# EAGLE design CamAdapter (EAGLE 6.5.0)
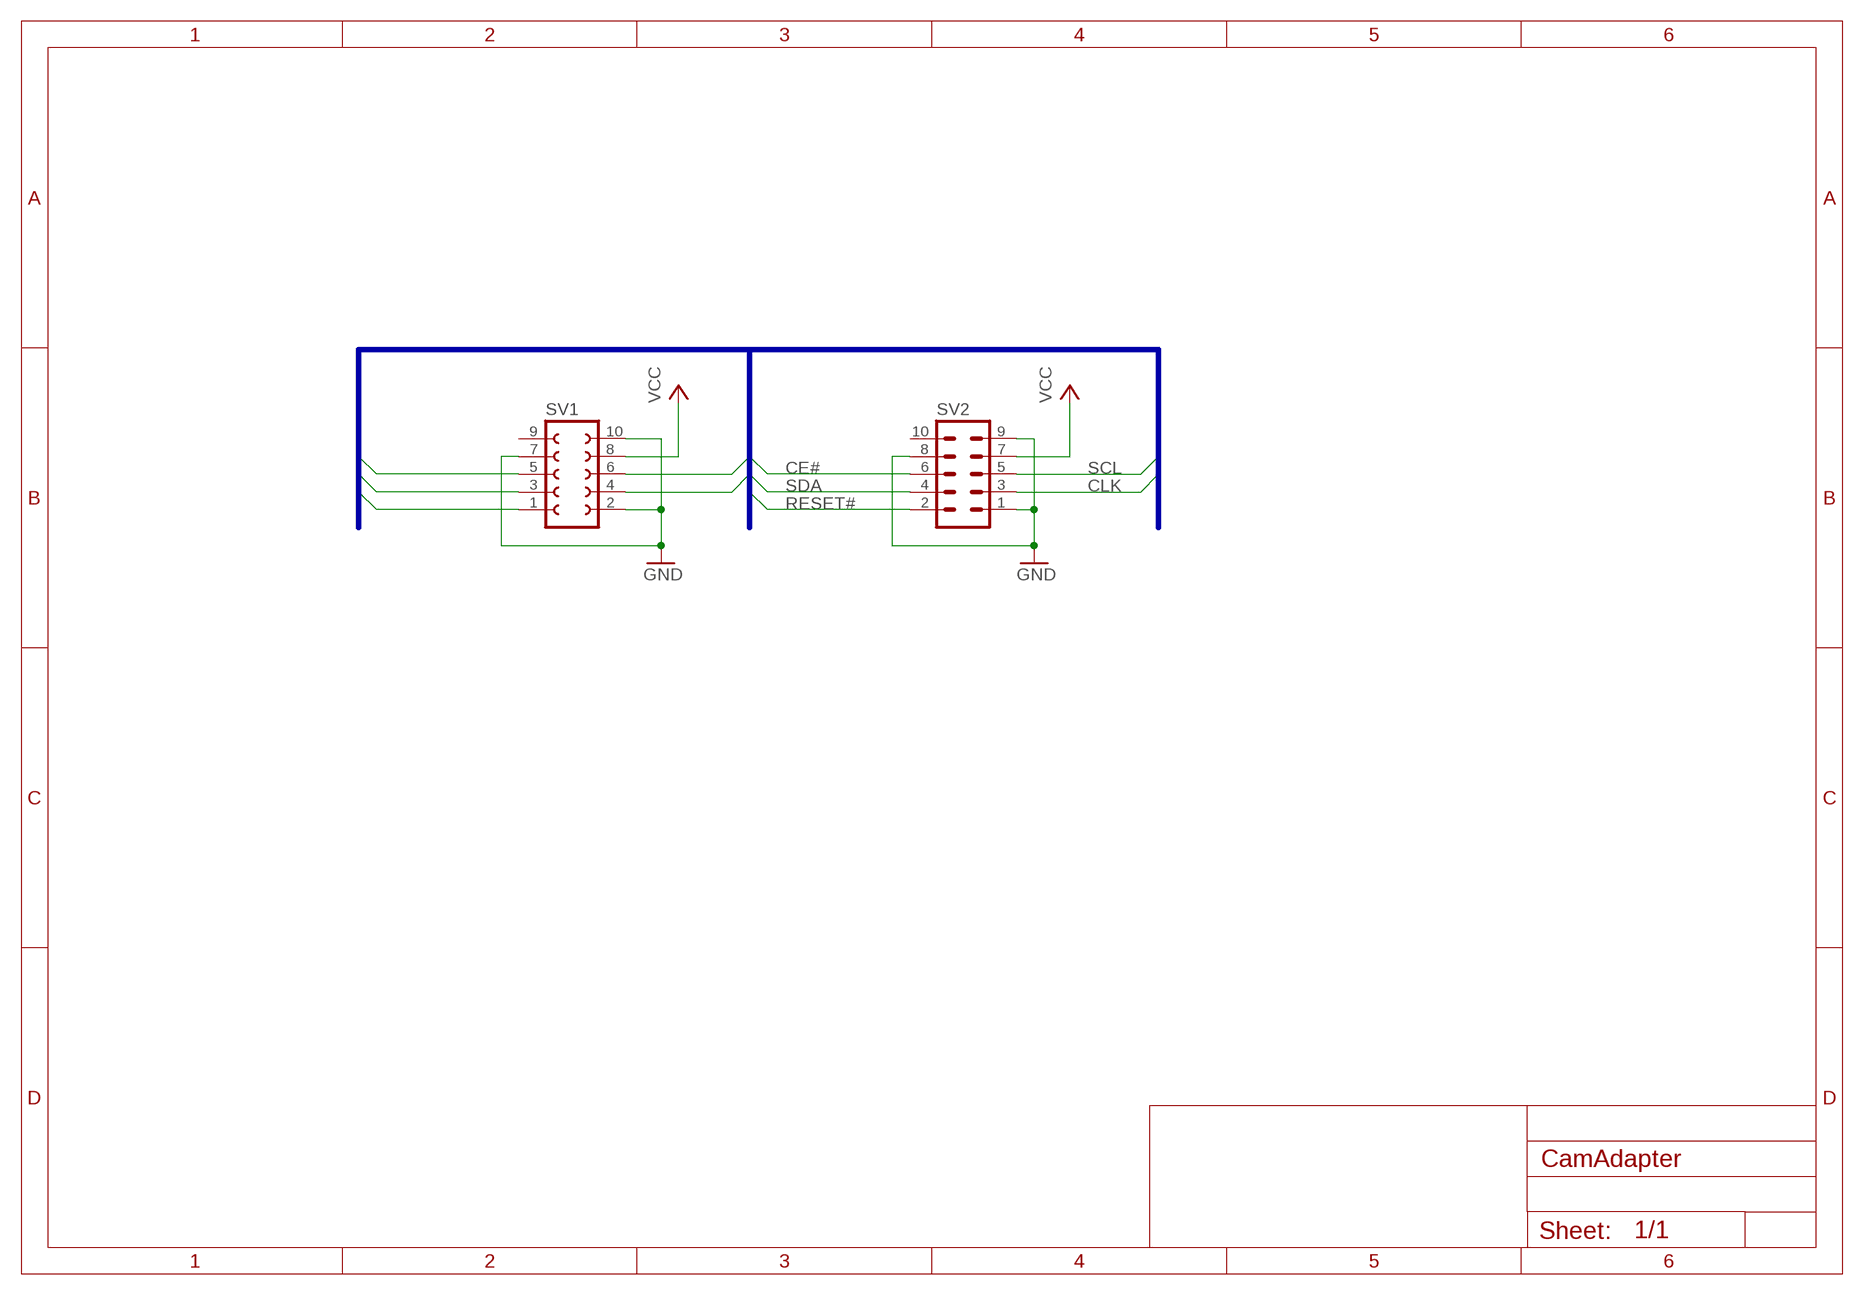
[diagram p0: schematic, sheet 1]

## Parts
SV1  FE05-2  [FE05-2]
SV2  ML10  [ML10]

## Nets
CE#: SV1.5 SV2.6
CLK: SV1.4 SV2.3
GND: SV1.2 SV1.7 SV1.10 SV2.1 SV2.8 SV2.9
RESET#: SV1.1 SV2.2
SCL: SV1.6 SV2.5
SDA: SV1.3 SV2.4
VCC: SV1.8 SV2.7
Unconnected: SV1.9 SV2.10

## Buses
SDA,SCL,CLK,CE#,RESET#

## Library data of the parts
SV1 = con-lsta:FE05-2: FEMALE HEADER; OC_FARNELL: unknown; OC_NEWARK: unknown
SV2 = con-harting-ml:ML10: HARTING; OC_FARNELL: unknown; OC_NEWARK: unknown

## Board
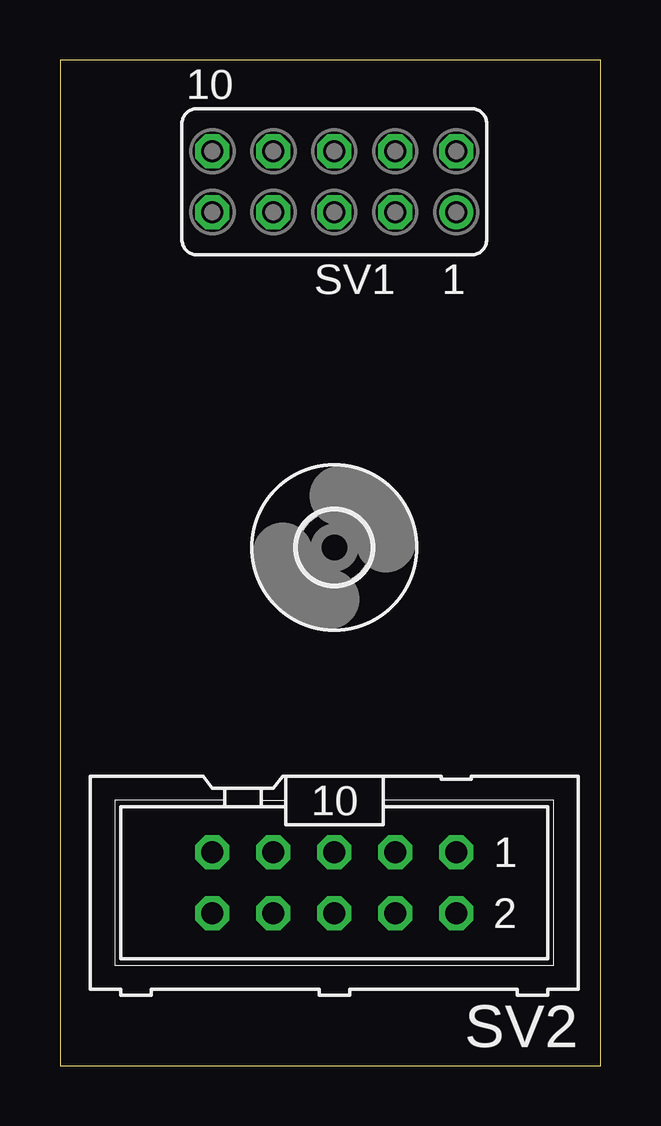
[diagram p1: board, top side]
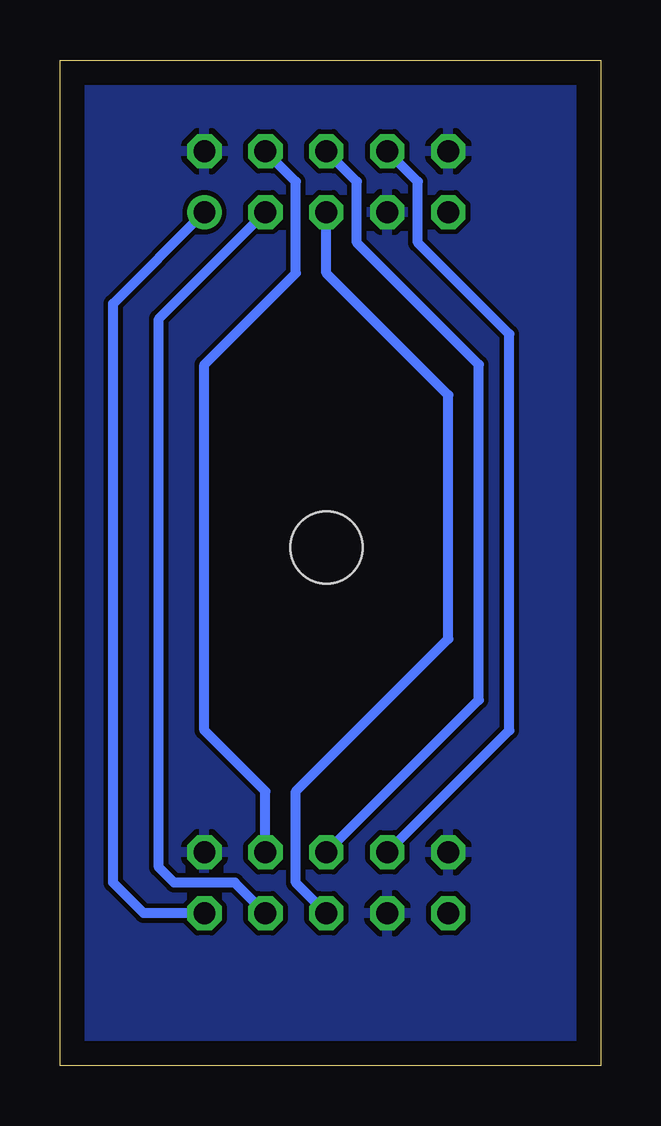
[diagram p2: board, bottom side, seen from below]

Size 22.53 x 41.9 mm. Coordinates in mm from the lower left corner, seen from the top.
Outline: 0,0 22.53,0 22.53,41.9 0,41.9 0,0
Copper layers (1*16): Top 0.035mm / dielectric 1.5mm / Bottom 0.035mm
Design rules "default": minimum track width 10mil, minimum drill 24mil, track to track 8mil, track to pad 8mil, pad to pad 8mil, via to via 8mil, smd to smd 8mil, copper to edge 40mil, drill to drill 8mil, minimum pad ring 10mil, minimum via ring 8mil, stop-mask expansion 4mil, vias tented up to drill 0mil, thermal gap 10mil

### Footprints (pad centres in the part's own frame; a part is rotated, then mirrored left to right if it is on the bottom)
FE05-2 = drill 0.914: 1 -5.08,1.27 | drill 0.914 octagon: 2 -5.08,-1.27; 3 -2.54,1.27; 4 -2.54,-1.27; 5 0,1.27; 6 0,-1.27; 7 2.54,1.27; 8 2.54,-1.27; 9 5.08,1.27; 10 5.08,-1.27
ML10 = drill 0.914 octagon: 1 -5.08,-1.27; 2 -5.08,1.27; 3 -2.54,-1.27; 4 -2.54,1.27; 5 0,-1.27; 6 0,1.27; 7 2.54,-1.27; 8 2.54,1.27; 9 5.08,-1.27; 10 5.08,1.27
3,0 = hole 3: 0,0

### Placement (x,y rotation side)
SV1  11.43,36.83 180 top
SV2  11.43,7.62 180 top
U$1  [3,0]  11.43,21.59 0 top

### Tracks (layer width: path | path; a pad name or v marks a point on that pad's centre or on a via)
CE#
  Bottom 0.406: SV2.6 12.7,7.62 12.7,11.43 6.35,17.78 6.35,27.94 11.43,33.02 SV1.5
CLK
  Bottom 0.406: SV2.3 13.97,11.43 16.51,13.97 16.51,29.21 12.7,33.02 12.7,36.83 SV1.4
GND
  pour Bottom: 0,41.91 22.86,41.91 22.86,0 0,0
RESET#
  Bottom 0.406: SV2.2 19.05,6.35 20.32,7.62 20.32,31.75 SV1.1
SCL
  Bottom 0.406: SV2.5 5.08,15.24 5.08,29.21 10.16,34.29 10.16,36.83 SV1.6
SDA
  Bottom 0.406: SV2.4 15.24,7.62 17.78,7.62 18.41,8.26 18.41,31.11 SV1.3
VCC
  Bottom 0.406: SV2.7 3.81,13.97 3.81,30.48 7.62,34.29 7.62,36.83 SV1.8